# Altium schematic sheet sch4.SchDoc
size 420 x 297 mm; Address1: Address1; Address2: Address2; Address3: Address3; Address4: Address4; DocumentNumber: АБВГ.123456.001 Э3; SheetNumber: 1; Scale: 1:1; DocumentType: Схема электрическая принципиальная; FirstReferrence: АБВГ.123456.001
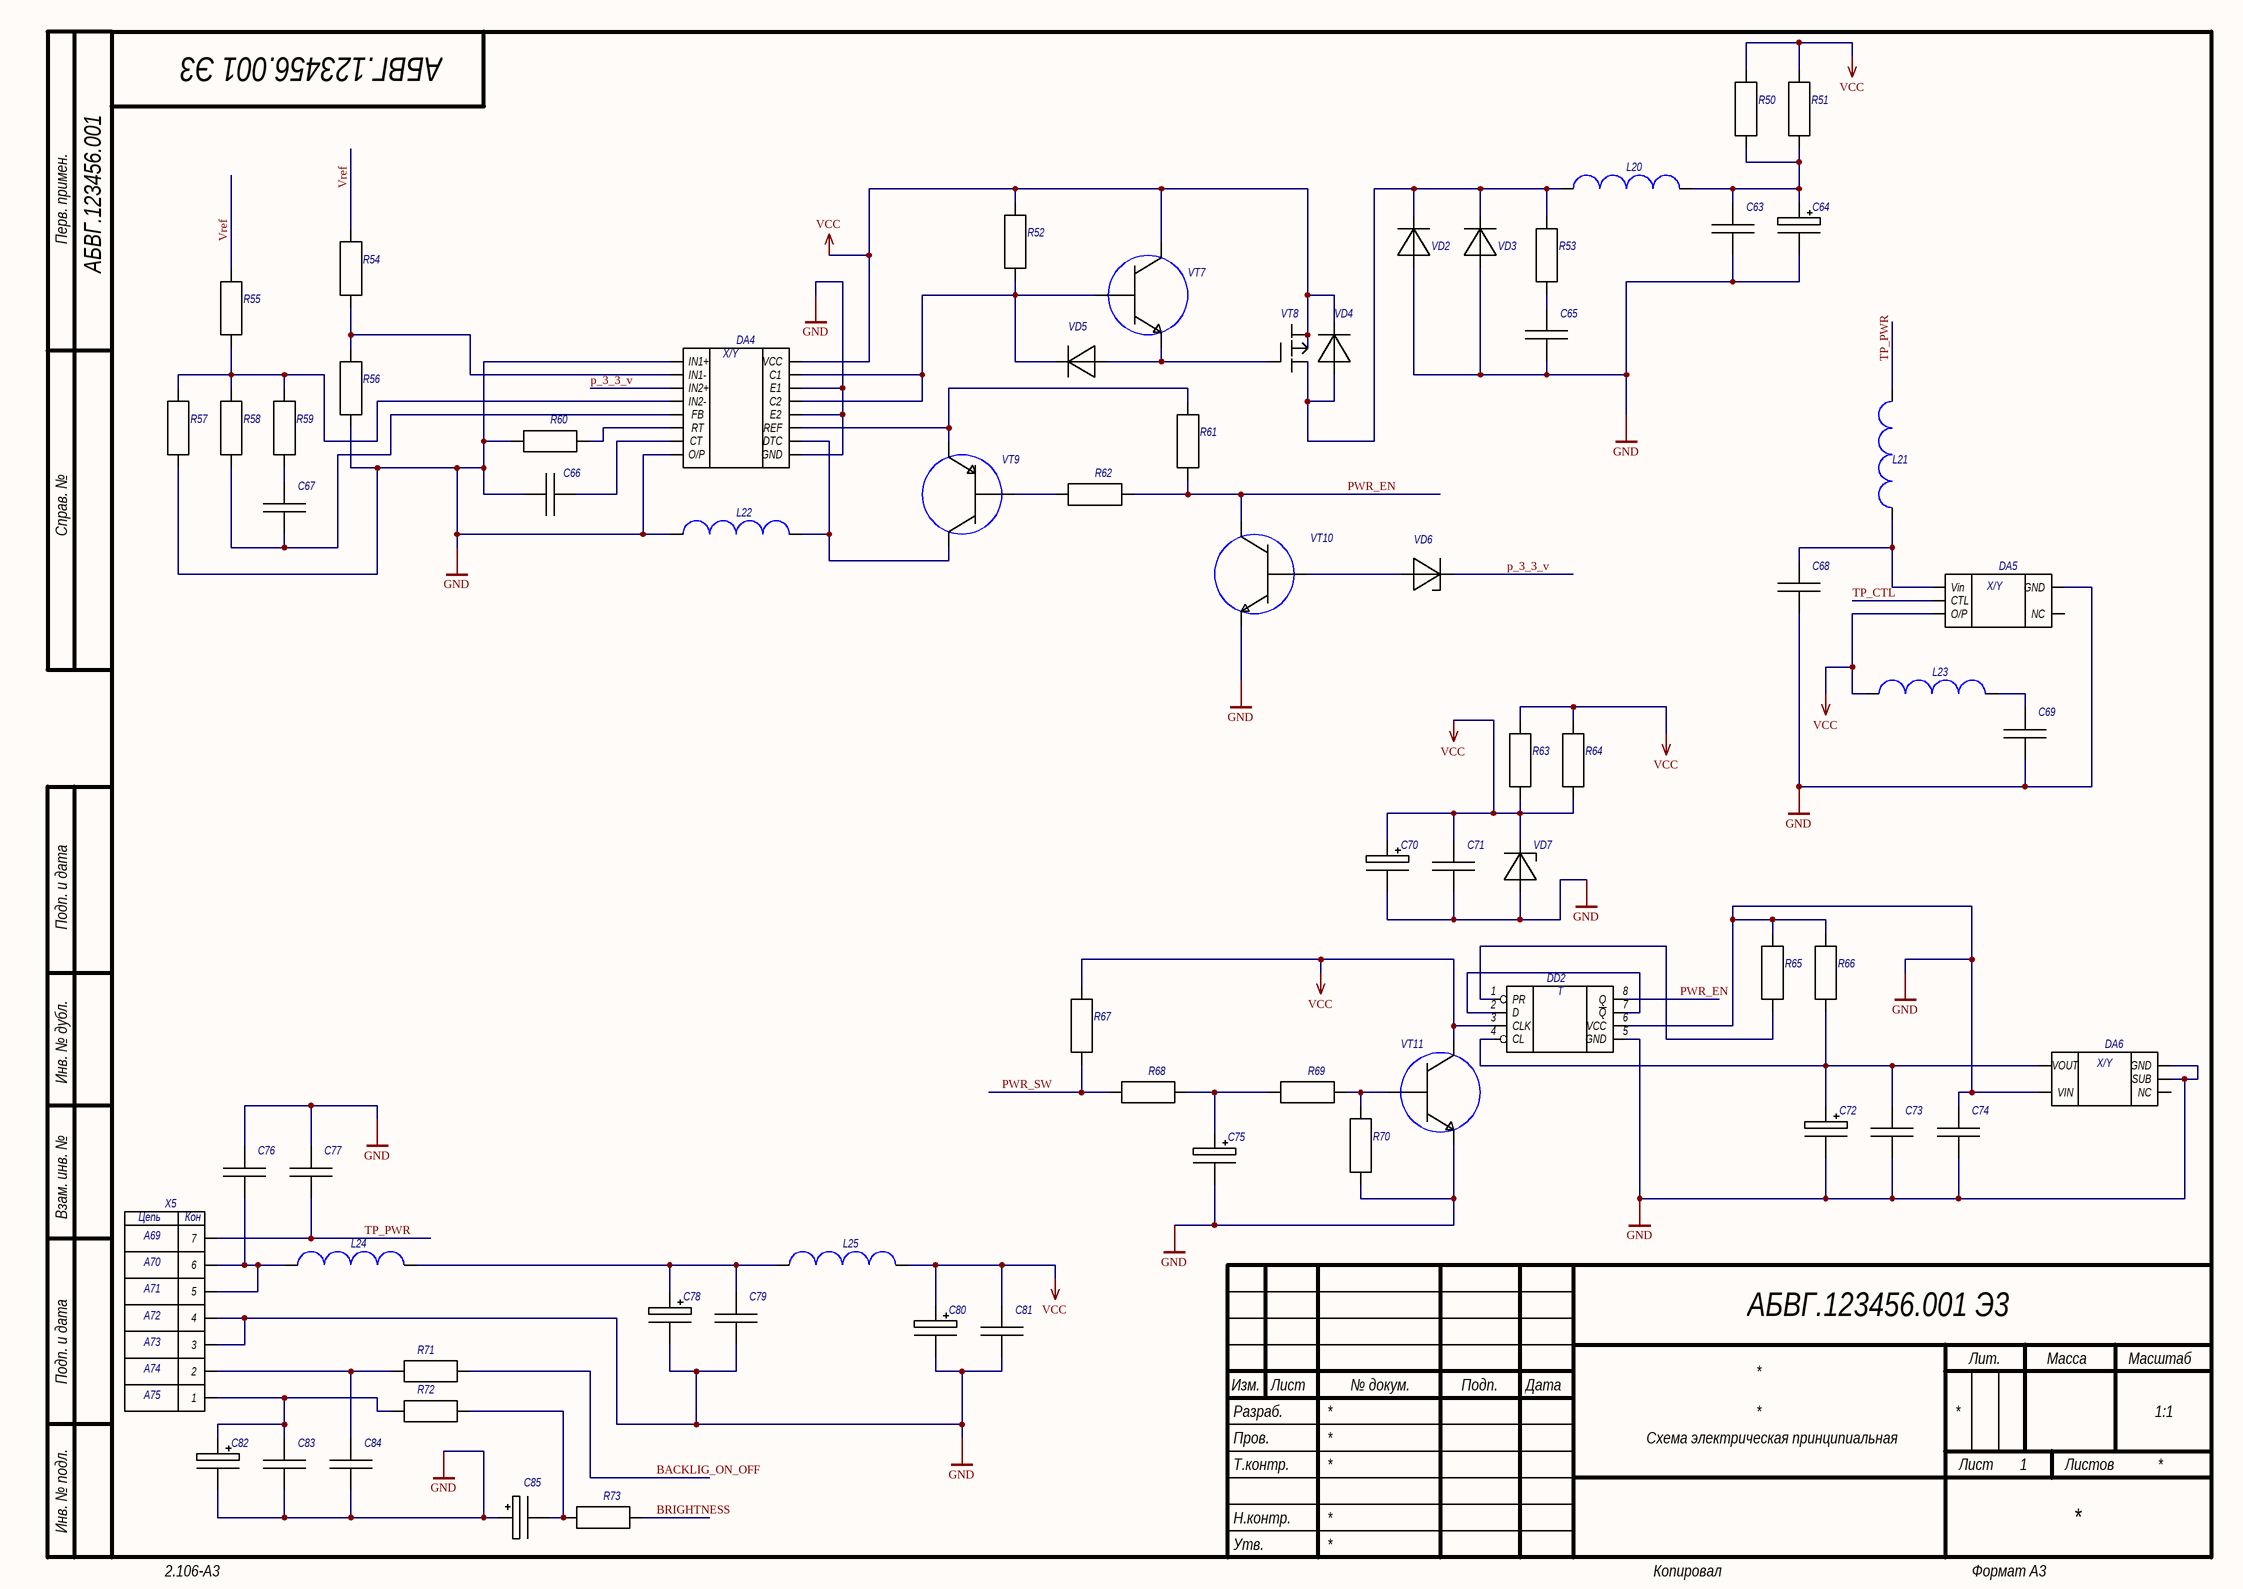
[diagram p0: sch4.SchDoc]

## Parts
C63  *  [Capacitor 0805]  (value not drawn)
C64  *  [Capacitor 0805]  (value not drawn)
C65  *  [Capacitor 0805]  (value not drawn)
C66  *  [Capacitor 0805]  (value not drawn)
C67  *  [Capacitor 0805]  (value not drawn)
C68  *  [Capacitor 0805]  (value not drawn)
C69  *  [Capacitor 0805]  (value not drawn)
C70  *  [Capacitor 0805]  (value not drawn)
C71  *  [Capacitor 0805]  (value not drawn)
C72  *  [Capacitor 0805]  (value not drawn)
C73  *  [Capacitor 0805]  (value not drawn)
C74  *  [Capacitor 0805]  (value not drawn)
C75  *  [Capacitor 0805]  (value not drawn)
C76  *  [Capacitor 0805]  (value not drawn)
C77  *  [Capacitor 0805]  (value not drawn)
C78  *  [Capacitor 0805]  (value not drawn)
C79  *  [Capacitor 0805]  (value not drawn)
C80  *  [Capacitor 0805]  (value not drawn)
C81  *  [Capacitor 0805]  (value not drawn)
C82  *  [Capacitor 0805]  (value not drawn)
C83  *  [Capacitor 0805]  (value not drawn)
C84  *  [Capacitor 0805]  (value not drawn)
C85  *  [Capacitor 0805]  (value not drawn)
DA4  *  [AP494A_1]  (value not drawn)
DA5  *  [PQ05]  (value not drawn)
DA6  IC103  [IC103_2]  (value not drawn)
DD2  *  [D FF]  (value not drawn)
L20  *  [Inductor 2520]  (value not drawn)
L21  *  [Inductor 2520]  (value not drawn)
L22  *  [Inductor 2520]  (value not drawn)
L23  *  [Inductor 2520]  (value not drawn)
L24  *  [Inductor 2520]  (value not drawn)
L25  *  [Inductor 2520]  (value not drawn)
R50  *  [Resistor 1206]  (value not drawn)
R51  *  [Resistor 1206]  (value not drawn)
R52  *  [Resistor 1206]  (value not drawn)
R53  *  [Resistor 1206]  (value not drawn)
R54  *  [Resistor 1206]  (value not drawn)
R55  *  [Resistor 1206]  (value not drawn)
R56  *  [Resistor 1206]  (value not drawn)
R57  *  [Resistor 1206]  (value not drawn)
R58  *  [Resistor 1206]  (value not drawn)
R59  *  [Resistor 1206]  (value not drawn)
R60  *  [Resistor 1206]  (value not drawn)
R61  *  [Resistor 1206]  (value not drawn)
R62  *  [Resistor 1206]  (value not drawn)
R63  *  [Resistor 1206]  (value not drawn)
R64  *  [Resistor 1206]  (value not drawn)
R65  *  [Resistor 1206]  (value not drawn)
R66  *  [Resistor 1206]  (value not drawn)
R67  *  [Resistor 1206]  (value not drawn)
R68  *  [Resistor 1206]  (value not drawn)
R69  *  [Resistor 1206]  (value not drawn)
R70  *  [Resistor 1206]  (value not drawn)
R71  *  [Resistor 1206]  (value not drawn)
R72  *  [Resistor 1206]  (value not drawn)
R73  *  [Resistor 1206]  (value not drawn)
VD2  *  [Diode]  (value not drawn)
VD3  *  [Diode]  (value not drawn)
VD4  Diode 1  [Diode]  (value not drawn)
VD5  *  [Diode]  (value not drawn)
VD6  *  [Diode]  (value not drawn)
VD7  *  [Diode]  (value not drawn)
VT7  *  [Transistor 1]  (value not drawn)
VT8  MOP TRANSISTOR  [TR]  (value not drawn)
VT9  *  [Transistor 1]  (value not drawn)
VT10  *  [Transistor 1]  (value not drawn)
VT11  *  [Transistor 1]  (value not drawn)
X5  *  [J601]  (value not drawn)

## Nets
GND: C63.1 C64.1 C65.1 C66.2 C68.1 C69.1 C70.1 C71.1 C72.1 C73.1 C74.1 C74.2 C75.1 C76.2 C77.2 C78.1 C79.1 C80.1 C81.1 C82.1 C83.1 C84.1 C85.2 DA4.1(IN1+) DA4.8(O/P) DA4.9(GND) DA4.12(E2) DA4.14(E1) DA5.5(GND) DA6.1(GND) DA6.2(SUB) DA6.5(VIN) DD2.5(GND) DD2.6(VCC) L22.1 R56.1 R57.1 R60.1 R65.2 R66.2 R70.1 VD2.1 VD3.1 VD7.1 VT10.2(EMITTER) VT11.1(KOLLECTOR) X5.3 X5.4
VCC: C70.2 C71.2 C80.2 C81.2 DA4.16(VCC) DA5.3(O/P) DD2.3(CLK) L23.1 L25.2 R50.2 R51.2 R52.2 R63.1 R63.2 R64.1 R64.2 R67.2 VD4.2 VD7.2 VT7.2(EMITTER) VT8.3 VT8.4 VT11.2(EMITTER)
BACKLIG_ON_OFF: R71.2
BRIGHTNESS: R73.2
p_3_3_v: DA4.3(IN2+) VD6.2
PWR_EN: DD2.8(Q) R61.1 R62.2 VT10.1(KOLLECTOR)
PWR_SW: R67.1 R68.1
TP_CTL: DA5.2(CTL)
TP_PWR: C77.1 L21.2 X5.7
Vref: R54.2 R55.2
NetC63_2: C63.2 C64.2 L20.2 R50.1 R51.1
NetC65_2: C65.2 R53.1
NetC66_1: C66.1 DA4.7(CT)
NetC67_1: C67.1 DA4.5(FB) R58.1
NetC67_2: C67.2 R59.1
NetC68_2: C68.2 DA5.1(Vin) L21.1
NetC69_2: C69.2 L23.2
NetC72_2: C72.2 C73.2 DA6.4(VOUT) DD2.4(CL) R66.1
NetC75_2: C75.2 R68.2 R69.1
NetC76_1: C76.1 L24.1 X5.5 X5.6
NetC78_2: C78.2 C79.2 L24.2 L25.1
NetC82_2: C82.2 C83.2 R72.1 X5.1
NetC84_2: C84.2 R71.1 X5.2
NetC85_1: C85.1 R72.2 R73.1
NetDA4_2: DA4.2(IN1-) R54.1 R56.2
NetDA4_4: DA4.4(IN2-) R55.1 R57.2 R58.2 R59.2
NetDA4_6: DA4.6(RT) R60.2
NetDA4_10: DA4.10(DTC) L22.2 VT9.2(EMITTER)
NetDA4_11: DA4.11(REF) R61.2 VT9.1(KOLLECTOR)
NetDA4_13: DA4.13(C2) DA4.15(C1) R52.1 VD5.2 VT7.3(BAZA)
NetDD2_1: DD2.1(PR) R65.1
NetDD2_2: DD2.2(D) DD2.7(~{Q})
NetL20_1: L20.1 R53.2 VD2.2 VD3.2 VD4.1 VT8.2
NetR62_1: R62.1 VT9.3(BAZA)
NetR69_2: R69.2 R70.2 VT11.3(BAZA)
NetVD5_1: VD5.1 VT7.1(KOLLECTOR) VT8.1
NetVD6_1: VD6.1 VT10.3(BAZA)

Not connected (* = marked no-connect by the designer): DA5 4(NC); DA6 3(NC)

## Notes on the sheet
- Перв. примен.
- Справ. №
- Подп. и дата
- Инв. № дубл.
- Взам. инв. №
- Разраб.
- Изм.
- Лист
- № докум.
- Подп.
- Дата
- Лит.
- Масса
- Масштаб
- Пров.
- Т.контр.
- Листов
- Инв. № подл.
- Утв.
- Н.контр.
- 2.106-A3
- Копировал
- Формат А3
- (in symbol 74F74) T
- (in symbol AP494A) X/Y
- (in symbol IC103) X/Y
- (in symbol J601) Цепь; Кон; A69; A70; A71; A72; A73; A74; A75
- (in symbol PQ05) X/Y

## Library data of the parts
C63 C65-C69 C71 C73 C74 C76 C77 C79 C81 C83 C84 = Capacitor: Model: *
C64 C70 C72 C75 C78 C80 C82 C85 = Capacitor Duga: Model: *
DA4 = AP494A
DA5 = PQ05
DD2 = 74F74
L20-L25 = Inductor: Model: *
R50-R73 = Resistor: Model: *
VD2 VD3 VD5 = Diode 1: Model: *
VD6 VD7 = Diode 2: Model: *
VT7 VT11 = Transistor 1
VT9 = Transistor 1_1
VT10 = Transistor 2_1
X5 = J601
VD4 = Diode 1: Model: *